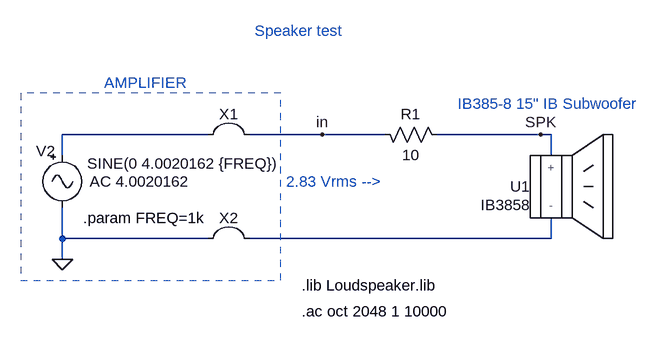
[diagram p0: schematic WooferTest.asc]
WooferTest.asc, the LTspice schematic file:
Version 4
SHEET 1 1664 680
WIRE -224 272 -448 272
WIRE -48 272 -160 272
WIRE 48 272 -48 272
WIRE 288 272 128 272
WIRE 304 272 288 272
WIRE -448 304 -448 272
WIRE 304 304 304 272
WIRE -448 432 -448 384
WIRE -224 432 -448 432
WIRE 304 432 304 400
WIRE 304 432 -160 432
WIRE -448 464 -448 432
FLAG -448 464 0
FLAG 288 272 SPK
FLAG -48 272 in
SYMBOL Misc\\signal -448 288 R0
WINDOW 0 -40 9 Left 2
WINDOW 3 38 28 Left 2
WINDOW 123 42 56 Left 2
WINDOW 39 42 84 Left 2
SYMATTR InstName V2
SYMATTR Value SINE(0 4.0020162 {FREQ})
SYMATTR Value2 AC 4.0020162
SYMBOL Misc\\jumper -192 208 R0
SYMATTR InstName X1
SYMBOL Misc\\jumper -192 368 R0
SYMATTR InstName X2
SYMBOL res 32 256 M90
WINDOW 0 0 56 VBottom 2
WINDOW 3 32 56 VTop 2
SYMATTR InstName R1
SYMATTR Value 10
SYMBOL Woofer 304 352 R0
WINDOW 38 -32 28 Right 2
SYMATTR SpiceModel IB3858
SYMATTR InstName U1
TEXT -80 544 Left 2 !.ac oct 2048 1 10000
TEXT -384 192 Left 2 ;AMPLIFIER
TEXT -416 400 Left 2 !.param FREQ=1k
TEXT -104 344 Left 2 ;2.83 Vrms -->
TEXT -80 504 Left 2 !.lib Loudspeaker.lib
TEXT -152 112 Left 2 ;Speaker test
TEXT 160 224 Left 2 ;IB385-8 15" IB Subwoofer
RECTANGLE Normal -112 208 -512 496 2

The netlist it stands for:
* WooferTest.asc
V2 in 0 SINE(0 4.0020162 {FREQ}) AC 4.0020162
R1 in SPK 10
XU1 SPK 0 IB3858  ; pins + -
.ac oct 2048 1 10000
* AMPLIFIER
.param FREQ=1k
* 2.83 Vrms -->
.lib Loudspeaker.lib
* Speaker test
* IB385-8 15" IB Subwoofer
.backanno
.end